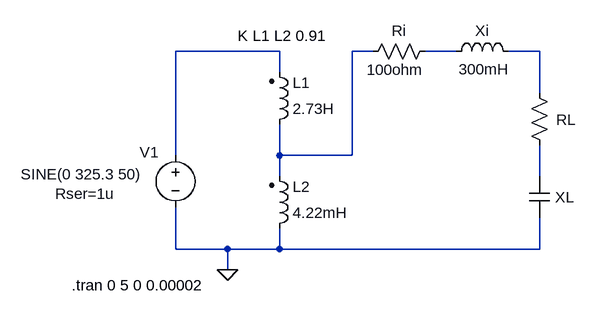
[diagram p0: schematic Draft1 - Copy.asc]
Draft1 - Copy.asc, the LTspice schematic file:
Version 4
SHEET 1 880 680
WIRE 256 16 96 16
WIRE 400 16 368 16
WIRE 528 16 480 16
WIRE 656 16 608 16
WIRE 256 48 256 16
WIRE 656 80 656 16
WIRE 96 176 96 16
WIRE 256 176 256 128
WIRE 368 176 368 16
WIRE 368 176 256 176
WIRE 256 208 256 176
WIRE 656 208 656 160
WIRE 96 320 96 256
WIRE 176 320 96 320
WIRE 256 320 256 288
WIRE 256 320 176 320
WIRE 656 320 656 272
WIRE 656 320 256 320
WIRE 176 352 176 320
FLAG 176 352 0
SYMBOL voltage 96 160 R0
WINDOW 0 -55 11 Left 2
WINDOW 3 -238 45 Left 2
WINDOW 123 0 0 Left 0
WINDOW 39 -185 75 Left 2
SYMATTR InstName V1
SYMATTR Value SINE(0 325.3 50)
SYMATTR SpiceLine Rser=1u
SYMBOL ind2 240 144 M180
WINDOW 0 36 80 Left 2
WINDOW 3 36 40 Left 2
SYMATTR InstName L1
SYMATTR Value 2.73H
SYMATTR Type ind
SYMBOL ind2 240 304 M180
WINDOW 0 36 80 Left 2
WINDOW 3 36 40 Left 2
SYMATTR InstName L2
SYMATTR Value 4.22mH
SYMATTR Type ind
SYMBOL res 496 0 R90
WINDOW 0 0 56 VBottom 2
WINDOW 3 60 62 VBottom 2
SYMATTR InstName Ri
SYMATTR Value 100ohm
SYMBOL ind 512 32 R270
WINDOW 0 32 56 VTop 2
WINDOW 3 -27 59 VTop 2
SYMATTR InstName Xi
SYMATTR Value 300mH
SYMBOL cap 640 208 R0
WINDOW 0 40 32 Left 2
WINDOW 3 40 60 Left 2
SYMATTR InstName XL
SYMATTR Value ""
SYMBOL res 640 64 R0
WINDOW 0 42 57 Left 2
WINDOW 3 42 85 Left 2
SYMATTR InstName RL
SYMATTR Value ""
TEXT 192 -8 Left 2 !K L1 L2 0.91
TEXT -64 376 Left 2 !.tran 0 5 0 0.00002

The netlist it stands for:
* Draft1 - Copy.asc
V1 N001 0 SINE(0 325.3 50) Rser=1u
L1 N002 N001 2.73H
L2 0 N002 4.22mH
Ri N003 N002 100ohm
L§Xi N003 N004 300mH
C§XL N005 0
RL N004 N005
K L1 L2 0.91
.tran 0 5 0 0.00002
.backanno
.end